# EAGLE design kitchenClock_v2 (EAGLE 6.1)
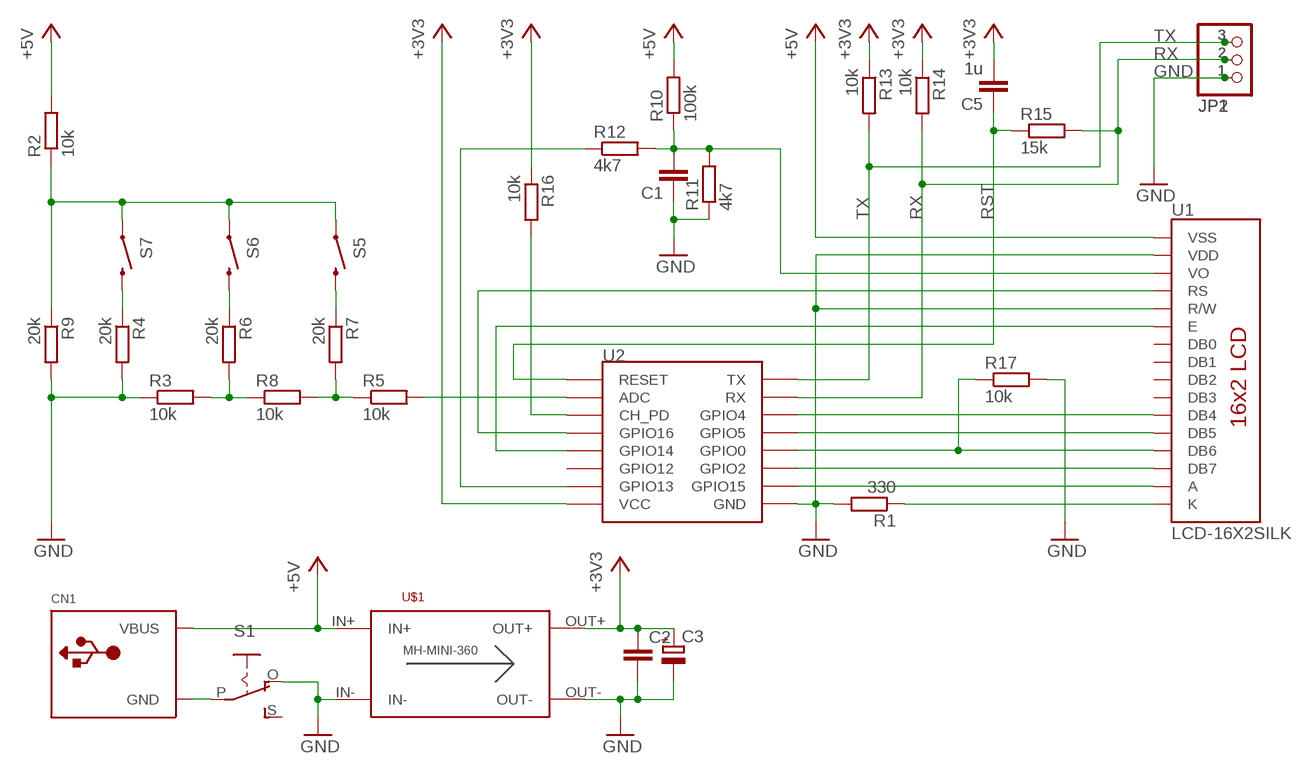
[diagram p0: schematic, sheet 1]

## Parts
C1  C-EU050-025X075  [C050-025X075]
C2  C-EU025-025X050  [C025-025X050]
C3  CPOL-EUTT2D5L  [TT2D5L]
C5  1u  C-EU025-025X050  [C025-025X050]
CN1  USBPWR-ONLY  [USB-MINIB-THM]
JP1  PINHD-1X3/90  [1X03/90]
JP2  PINHD-1X3  [1X03]
R1  330  R-EU_0204/7  [0204/7]
R2  10k  R-EU_0204/7  [0204/7]
R3  10k  R-EU_0204/7  [0204/7]
R4  20k  R-EU_0204/7  [0204/7]
R5  10k  R-EU_0204/7  [0204/7]
R6  20k  R-EU_0204/7  [0204/7]
R7  20k  R-EU_0204/7  [0204/7]
R8  10k  R-EU_0204/7  [0204/7]
R9  20k  R-EU_0204/7  [0204/7]
R10  100k  R-EU_0204/7  [0204/7]
R11  4k7  R-EU_0204/7  [0204/7]
R12  4k7  R-EU_0204/7  [0204/7]
R13  10k  R-EU_0204/7  [0204/7]
R14  10k  R-EU_0204/7  [0204/7]
R15  15k  R-EU_0204/7  [0204/7]
R16  10k  R-EU_0204/7  [0204/7]
R17  10k  R-EU_M0805  [M0805]
S1  EG1218S  [EG1218]
S5  SWITCH-MOMENTARY-2SIDE_EZ  [TACTILE-PTH-SIDEEZ]
S6  SWITCH-MOMENTARY-2SIDE_EZ  [TACTILE-PTH-SIDEEZ]
S7  SWITCH-MOMENTARY-2SIDE_EZ  [TACTILE-PTH-SIDEEZ]
U1  LCD-16X2SILK  [LCD-16X2]
U2  ESP12EDIP  [ESP-12-BREAKOUT]
U$1  DC-DC_CONV_MINISTD  [DC-DC_CONV_MINI]

## Nets
+3V3: C2.1 C3.+ C5.2 R13.1 R14.1 R16.1 U2.P$1(VCC) U$1.OUT+
+5V: CN1.VBUS R2.2 R10.2 U1.1(VSS) U$1.IN+
GND: C1.1 C2.2 C3.- JP1.1 JP2.1 R1.2 R3.1 R4.2 R9.2 R11.1 R17.2 S1.O U1.2(VDD) U1.5(R/W) U2.P$9(GND) U$1.IN- U$1.OUT-
N$1: R1.1 U1.16(K)
N$2: R12.1 U2.P$2(GPIO13)
N$3: U1.4(RS) U2.P$5(GPIO16)
N$4: U1.6(E) U2.P$4(GPIO14)
N$5: U1.11(DB4) U2.P$14(GPIO4)
N$6: U1.12(DB5) U2.P$13(GPIO5)
N$7: R17.1 U1.13(DB6) U2.P$12(GPIO0)
N$8: U1.14(DB7) U2.P$11(GPIO2)
N$9: U1.15(A) U2.P$10(GPIO15)
N$10: R5.2 U2.P$7(ADC)
N$11: R2.1 R9.1 S5.1 S6.1 S7.1
N$12: CN1.GND CN1.GND1(GND) CN1.GND2(GND) CN1.GND3(GND) CN1.GND4(GND) S1.P
N$13: R3.2 R6.2 R8.1
N$14: R5.1 R7.2 R8.2
N$15: R7.1 S5.2
N$16: R6.1 S6.2
N$17: R4.1 S7.2
N$18: R16.2 U2.P$6(CH_PD)
N$19: C1.2 R10.1 R11.2 R12.2 U1.3(VO)
RST: C5.1 R15.1 U2.P$8(RESET)
RX: JP1.2 JP2.2 R14.2 R15.2 U2.P$15(RX)
TX: JP1.3 JP2.3 R13.2 U2.P$16(TX)
Unconnected: S1.S U1.7(DB0) U1.8(DB1) U1.9(DB2) U1.10(DB3) U2.P$3(GPIO12)

## Library data of the parts
C1 C2 C5 = rcl:C-EU: CAPACITOR, European symbol
C3 = rcl:CPOL-EU: POLARIZED CAPACITOR, European symbol
CN1 = _MY_OWN_LIB:USB: USB Connectors USBMINIB - Surface Mount Female Mini-B USB Connector 4UConnector: 06564 By microbuilder.eu Thru-hole RA Female Mini-B USB Connector 4UConnector: 18732 By ladyada.net
JP1 JP2 = pinhead:PINHD-1X3: PIN HEADER
R1-R17 = rcl:R-EU_: RESISTOR, European symbol
S1 = _MY_OWN_LIB:EG1218: SLIDING SWITCH 0.1" spacing through hole, vertical SPDT slide switch http://www.ladyada.net/library/pcb/eaglelibrary.html
S5-S7 = SparkFun-Electromechanical:SWITCH-MOMENTARY-2: Various NO switches- pushbuttons, reed, etc
U1 = SparkFun-Displays:LCD-16X2: Standard text-only 16x2 parallel input LCD
U2 = _MY_OWN_LIB:ESP12E: ESP12E Module
U$1 = _MY_OWN_LIB:DC-DC_CONV_MINI

## Board
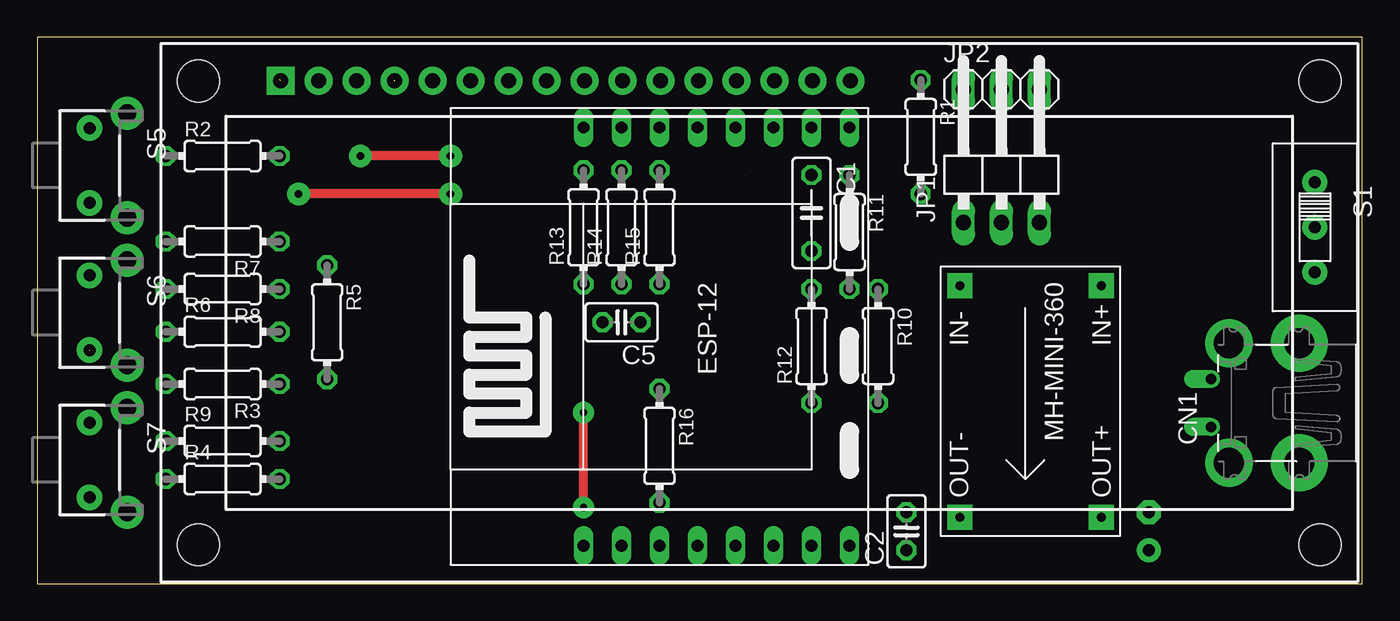
[diagram p1: board, top side]
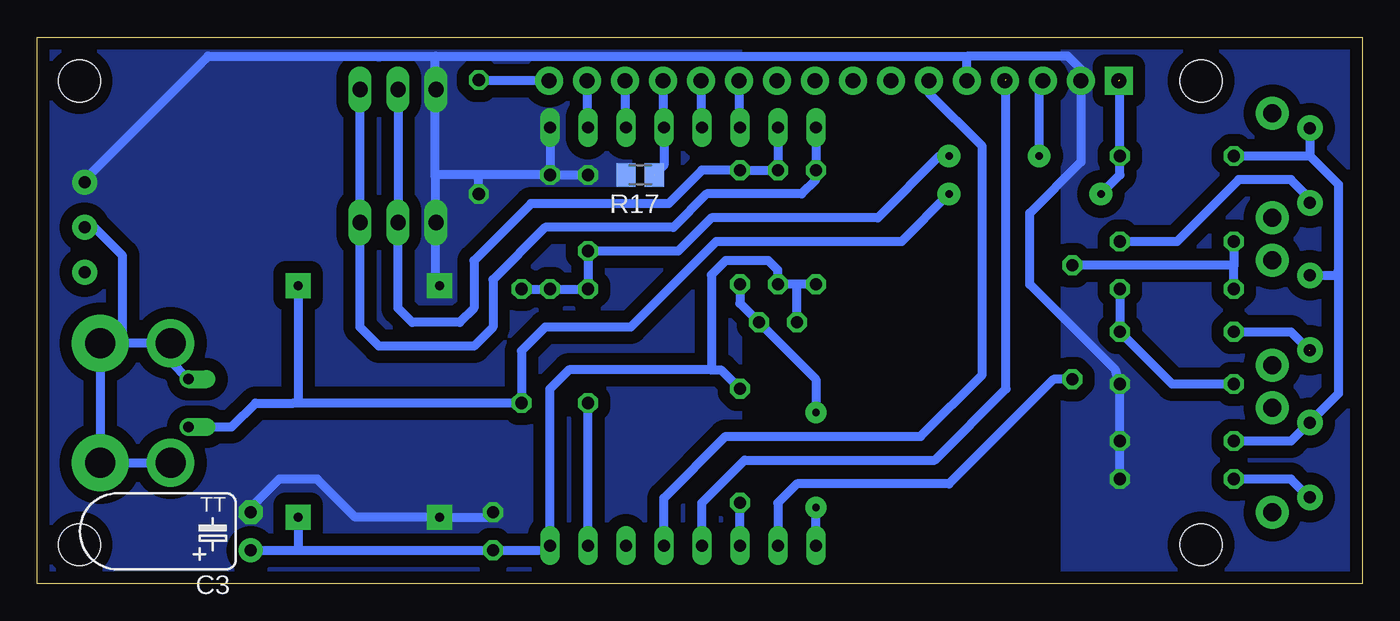
[diagram p2: board, bottom side, seen from below]

Size 88.56 x 36.5 mm. Coordinates in mm from the lower left corner, seen from the top.
Outline: 0,0 88.56,0 88.56,36.5 0,36.5 0,0
Copper layers (1*16): Top 0.035mm / dielectric 1.5mm / Bottom 0.035mm
Design rules: minimum track width 10mil, minimum drill 24mil, track to track 12mil, track to pad 12mil, pad to pad 12mil, via to via 12mil, smd to smd 10mil, copper to edge 12mil, drill to drill 12mil, minimum pad ring 10mil, minimum via ring 10mil, stop-mask expansion 4mil, vias tented up to drill 0mil, thermal gap 12mil

### Footprints (pad centres in the part's own frame; a part is rotated, then mirrored left to right if it is on the bottom)
C050-025X075 = drill 0.813 octagon: 1 -2.54,0; 2 2.54,0
C025-025X050 = drill 0.813 octagon: 1 -1.27,0; 2 1.27,0
TT2D5L = drill 0.813 pad 1.6: + -1.27,0 | drill 0.813 pad 1.6 octagon: - 1.27,0
USB-MINIB-THM = drill 0.7 offset: GND 1.6,9.8; VBUS -1.6,9.8 | drill 2 pad 3.81: GND1 -4,3.9; GND4 4,3.9 | drill 2 pad 3.2: GND2 -4,8.6; GND3 4,8.6
1X03/90 = drill 1.016 long: 1 -2.54,-3.81; 2 0,-3.81; 3 2.54,-3.81
1X03 = drill 1.016 long: 1 -2.54,0; 2 0,0; 3 2.54,0
0204/7 = drill 0.813 octagon: 1 -3.81,0; 2 3.81,0
M0805 = smd 1.3 x 1.6: 1 -0.95,0; 2 0.95,0
EG1218 = drill 0.8 pad 1.676: O -3,0; P 0,0; S 3,0
TACTILE-PTH-SIDEEZ = drill 0.8 pad 1.7: 1 -2.5,0; 2 2.5,0 | drill 1.2 pad 2.2: ANCHOR1 -3.5,2.5; ANCHOR2 3.5,2.5
LCD-16X2 = drill 1.016 pad 1.88 square: 1 -32,15.5 | drill 1.016 pad 1.88: 2 -29.46,15.5; 3 -26.92,15.5; 4 -24.38,15.5; 5 -21.84,15.5; 6 -19.3,15.5; 7 -16.76,15.5; 8 -14.22,15.5; 9 -11.68,15.5; 10 -9.14,15.5; 11 -6.6,15.5; 12 -4.06,15.5; 13 -1.52,15.5; 14 1.02,15.5; 15 3.56,15.5; 16 6.1,15.5 | hole 2.8: -37.5,15.5; -37.5,-15.5; 37.5,15.5; 37.5,-15.5
ESP-12-BREAKOUT = drill 0.8 long: P$1 0,0; P$2 0,2.54; P$3 0,5.08; P$4 0,7.62; P$5 0,10.16; P$6 0,12.7; P$7 0,15.24; P$8 0,17.78; P$9 27.94,0; P$10 27.94,2.54; P$11 27.94,5.08; P$12 27.94,7.62; P$13 27.94,10.16; P$14 27.94,12.7; P$15 27.94,15.24; P$16 27.94,17.78
DC-DC_CONV_MINI = drill 0.6 pad 1.676 square: IN+ 16.73,1.27; IN- 16.73,10.73; OUT+ 1.27,1.27; OUT- 1.27,10.73

### Placement (x,y rotation side)
C1  51.75,24.77 270 top
C2  58.1,3.49 90 top
C3  74.3,3.49 90 bottom
C5  39.05,17.46 180 top
CN1  88.27,12.06 90 top
JP1  64.45,27.94 0 top
JP2  64.45,33.02 0 top
R1  59.05,29.84 270 top
R2  12.38,28.57 0 top
R3  12.38,13.34 180 top
R4  12.38,6.99 0 top
R5  19.37,17.46 270 top
R6  12.38,16.83 0 top
R7  12.38,22.86 180 top
R8  12.38,19.68 180 top
R9  12.38,9.53 0 top
R10  56.2,15.88 270 top
R11  54.29,23.5 270 top
R12  51.75,15.88 90 top
R13  36.51,23.81 90 top
R14  39.05,23.81 90 top
R15  41.59,23.81 90 top
R16  41.59,9.21 270 top
R17  48.26,27.3 180 bottom
S1  85.41,23.81 270 top
S5  3.49,27.94 270 top
S6  3.49,18.1 270 top
S7  3.49,8.26 270 top
U1  48.26,18.1 0 top
U2  54.29,2.54 90 top
U$1  72.39,3.17 90 top

### Tracks (layer width: path | path; a pad name or v marks a point on that pad's centre or on a via)
+3V3
  Bottom 0.61: R13.1 37.78,20 | 37.78,20 R14.1 39.05,20.95 39.69,21.59 42.55,21.59 43.5,20.64 43.5,14.29 | C5.2 37.78,20 | 43.5,14.29 53.02,14.29 54.29,13.02 U2.P$1 54.61,2.22 C2.1 71.12,2.22 | 43.5,14.29 42.86,14.29 R16.1 | C3.+ 71.12,2.22 | U$1.OUT+ 71.12,2.22
+5V  (via drill 0.5 pad 1.52)  (2 unrouted)
  Top 0.61: v27.62,26.04 v17.46,26.04
  Bottom 0.61: v17.46,26.04 16.19,27.3 R2.2 16.19,33.66 | v27.62,26.04 30.8,22.86 43.18,22.86 48.9,17.14 54.61,17.14 56.2,15.56 R10.2 71.12,12.06 | 71.12,12.06 71.42,12.06 | CN1.VBUS 75.58,10.46 73.98,12.06 71.44,12.06 | U$1.IN+ 71.12,12.06
GND
  Bottom 0.61: 26.35,35.24 19.68,35.24 18.8,34.36 U1.2 18.8,28.19 22.23,24.77 22.23,20 16.51,14.29 R3.1 R9.2 R4.2 | U1.5 26.42,35.17 26.35,35.24 | 61.91,35.24 77.15,35.24 85.41,26.99 S1.O | 61.91,35.24 26.35,35.24 | 61.98,33.02 61.98,27.3 61.91,27.3 | 61.98,33.02 61.98,35.18 61.91,35.24 | R11.1 59.05,27.3 | 59.05,27.3 61.91,27.3 | R1.2 59.05,27.3 | R11.1 C1.1 | U2.P$9 R11.1 | 61.91,27.3 61.98,27.24 61.98,24.45 | JP2.1 61.98,33.02 | 61.91,20 61.81,19.91 U$1.IN- 61.98,20.22 61.98,24.45 | JP1.1 61.98,24.45 | C3.- 74.3,5.08 72.39,6.99 69.85,6.99 67.31,4.45 U$1.OUT- 58.42,4.45 C2.2
  pour Bottom (isolate 0.813, no thermals): 41.59,0 88.58,0 88.58,36.51 41.59,36.51
  pour Bottom (isolate 0.813, no thermals): 0,-0.32 20,-0.32 20,36.51 0,36.51
N$1
  Bottom 0.61: U1.16 59,33.6 R1.1
N$2
  Bottom 0.61: U2.P$2 R12.1
N$3  (1 unrouted)
  Bottom 0.61: U2.P$5 44.13,5.4 41.27,8.26 28.57,8.26 23.81,13.02 23.81,33.66
N$4
  Bottom 0.61: U2.P$4 46.67,5.71 42.55,9.84 29.53,9.84 25.4,13.97 25.4,29.21 28.96,32.77 U1.6
N$5
  Bottom 0.61: U1.11 41.66,30.55 U2.P$14
N$6
  Bottom 0.61: U1.12 44.2,30.55 U2.P$13
N$7  (1 unrouted)
  Bottom 0.61: U1.13 46.74,30.55 U2.P$12 46.67,27.94 R17.1
N$8
  Bottom 0.61: U1.14 49.28,30.55 U2.P$11
N$9
  Bottom 0.61: U1.15 51.82,30.55 U2.P$10
N$10
  Bottom 0.61: R5.2 20.64,13.65 27.62,6.67 37.78,6.67 39.05,5.4 U2.P$7
N$11
  Bottom 0.61: 1.59,20.95 1.59,12.7 3.49,10.79 | S6.1 1.63,20.6 1.59,20.95 | 3.49,10.79 4.76,9.53 R9.1 | S7.1 3.49,10.79 | R2.1 3.49,28.57 | 3.49,28.57 1.59,26.67 1.59,20.95 | S5.1 3.49,28.57
N$12
  Bottom 0.61: CN1.GND4 CN1.GND1 CN1.GND2 | CN1.GND 79.67,14.87 CN1.GND3 CN1.GND4 | CN1.GND4 83,16.07 82.87,16.19 82.87,21.91 84.77,23.81 S1.P
N$13
  Bottom 0.61: R8.1 R6.2 12.7,13.34 R3.2
N$14
  Bottom 0.61: R8.2 8.57,21.27 | R7.2 8.57,21.27 | 8.57,21.27 R5.1
N$15
  Bottom 0.61: S5.2 3.53,25.76 4.76,26.99 8.26,26.99 12.38,22.86 R7.1
N$16  (1 unrouted)
  Bottom 0.61: R6.1 4.76,16.83 3.49,15.56
N$17
  Bottom 0.61: S7.2 3.49,5.71 4.76,6.99 R4.1
N$18
  Bottom 0.61: U2.P$6 R16.2
N$19  (via drill 0.5 pad 1.52)
  Top 0.61: v27.62,28.57 v21.59,28.57
  Bottom 0.61: v21.59,28.57 21.59,33.35 U1.3 | R10.1 R11.2 R12.2 C1.2 45.72,22.23 43.5,24.45 32.38,24.45 28.26,28.57 v27.62,28.57
RST  (via drill 0.5 pad 1.42)
  Top 0.61: v36.51,5.08 v36.51,11.43
  Bottom 0.61: U2.P$8 v36.51,5.08 | R15.1 41.59,18.73 C5.1 36.51,13.65 v36.51,11.43
RX
  Bottom 0.61: U2.P$15 R14.2 R15.2 44.13,27.62 46.35,25.4 55.56,25.4 59.37,21.59 59.37,18.41 60.33,17.46 63.5,17.46 64.45,18.41 JP1.2 JP2.2
TX
  Bottom 0.61: R13.2 U2.P$16 36.51,26.99 37.47,26.04 43.81,26.04 46.04,23.81 54.61,23.81 58.1,20.32 58.1,17.14 59.37,15.88 65.72,15.88 66.99,17.14 JP1.3 JP2.3